# EAGLE design esp8266_minsys (EAGLE 9.6.2)
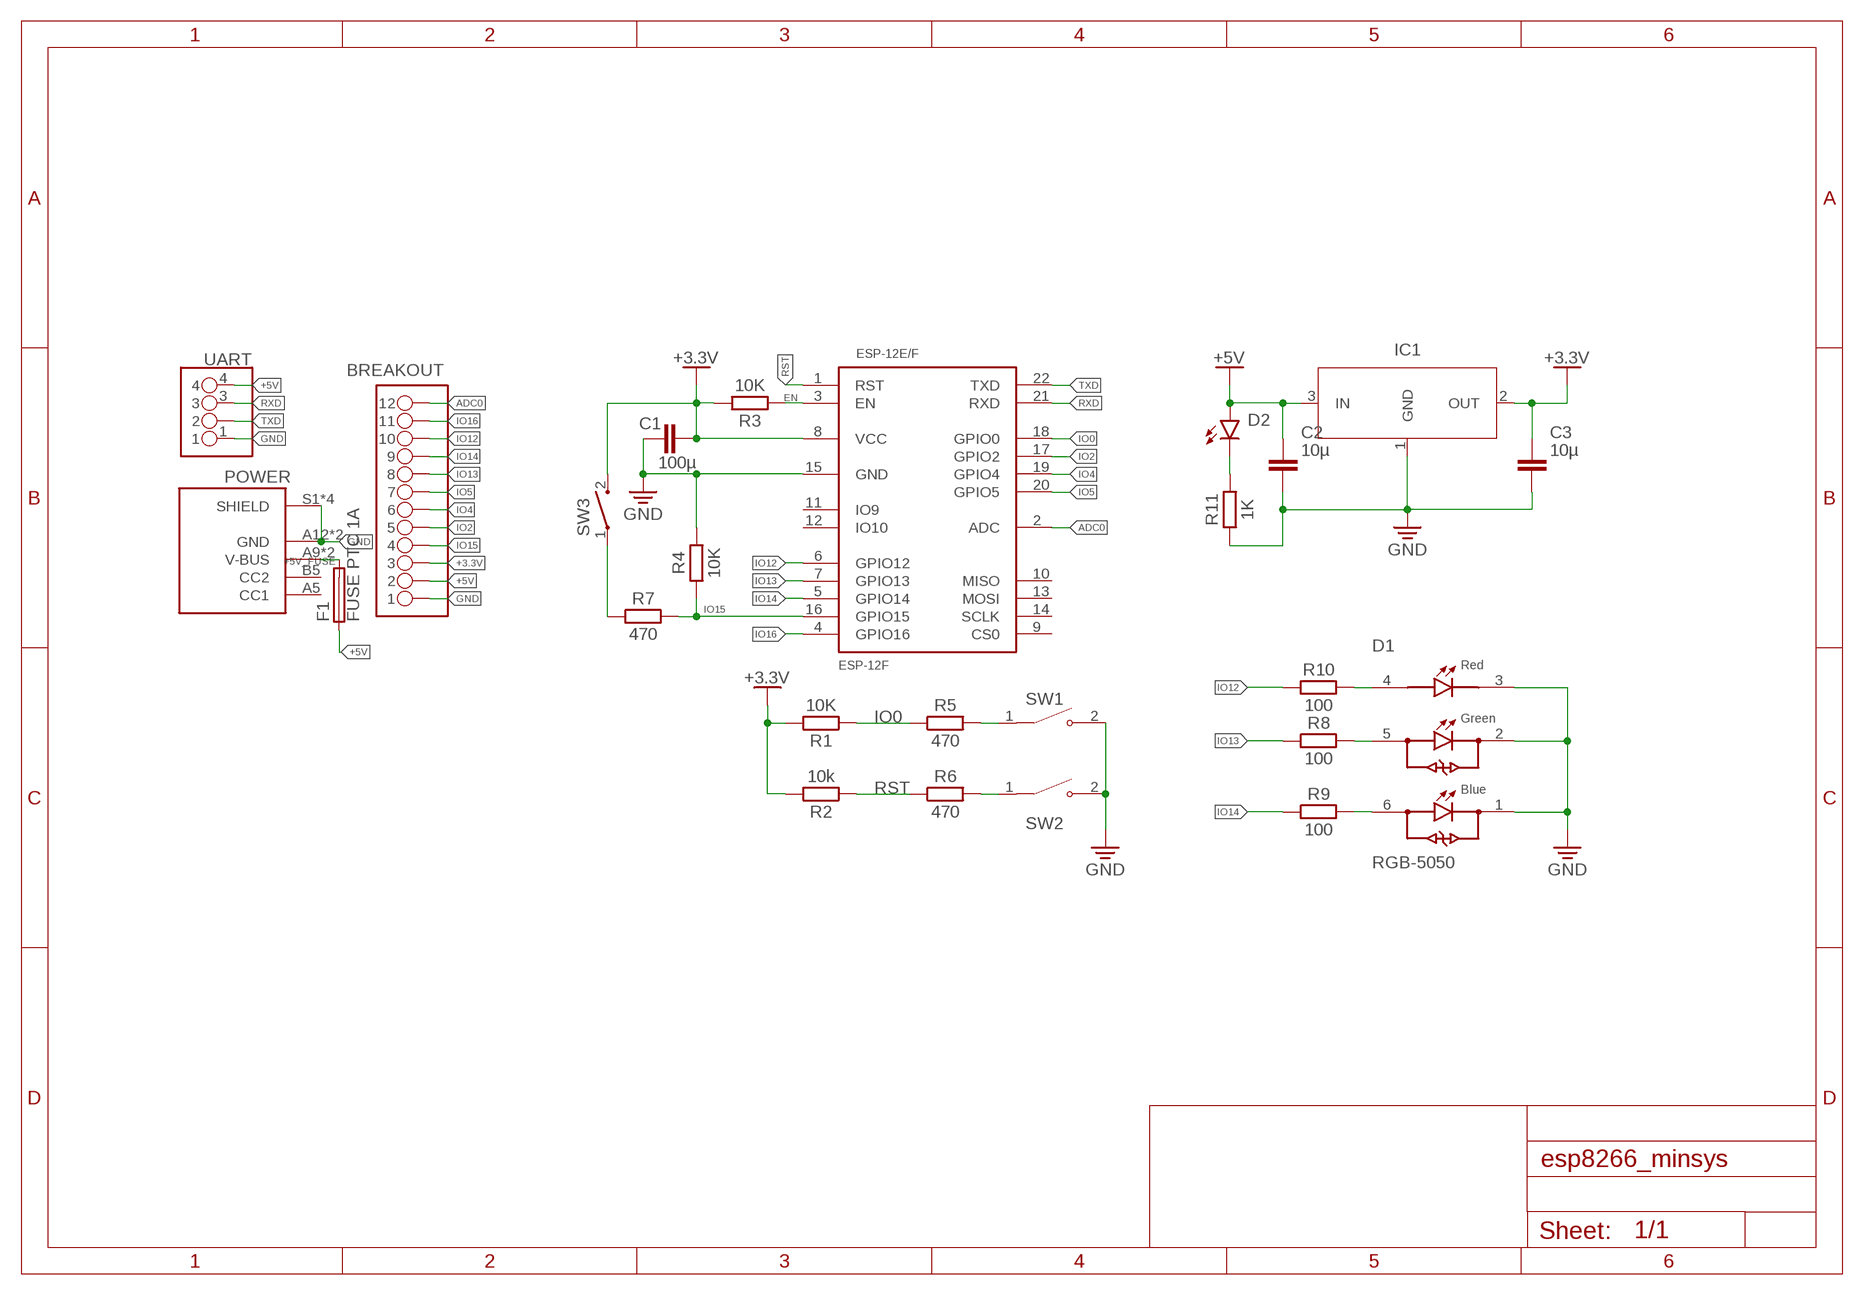
[diagram p0: schematic, sheet 1]

## Parts
BREAKOUT  PINHD-1X12-BACKUP_1X12M  [1X12]
C1  100µ  C_TANTALUM-2412(6032-METRIC)  [CAPM6032X280]
C2  10µ  C_CHIP-0805(2012-METRIC)  [CAPC2012X110]
C3  10µ  C_CHIP-0805(2012-METRIC)  [CAPC2012X110]
D1  RGB-5050  [RGB-5050]
D2  LED_RED  CHIP-FLAT-R_0805  [LEDC2012X110N_FLAT-R]
ESP-12E/F  ESP-12F  [ESP-12F]
F1  FUSE PTC 1A  FUSE_CHIP-1206(3216-METRIC)  [FUSC3215X82N]
IC1  NCP1117ST33T3G  NCP1117ST33T3GSOT-223  [SOT230P700X170-4]
POWER  SOCKET-C  [SOCKET-C]
R1  10K  R_CHIP-0805(2012-METRIC)  [RESC2012X65]
R2  10k  R_CHIP-0805(2012-METRIC)  [RESC2012X65]
R3  10K  R_CHIP-0805(2012-METRIC)  [RESC2012X65]
R4  10K  R_CHIP-0805(2012-METRIC)  [RESC2012X65]
R5  470  R_CHIP-0805(2012-METRIC)  [RESC2012X65]
R6  470  R_CHIP-0805(2012-METRIC)  [RESC2012X65]
R7  470  R_CHIP-0805(2012-METRIC)  [RESC2012X65]
R8  100  R_CHIP-0805(2012-METRIC)  [RESC2012X65]
R9  100  R_CHIP-0805(2012-METRIC)  [RESC2012X65]
R10  100  R_CHIP-0805(2012-METRIC)  [RESC2012X65]
R11  1K  R_CHIP-0805(2012-METRIC)  [RESC2012X65]
SW1  SWITCH-2P  [SWITCH-2P]
SW2  SWITCH-2P  [SWITCH-2P]
SW3  SWITCH  [SW_1437566-3]
UART  PINHD-1X04_1X04M  [1X04]

## Nets
+3.3V: BREAKOUT.3 C1.2 C3.1 ESP-12E/F.8(VCC) IC1.2(OUT) R1.2 R2.2 R3.2 SW3.2
+5V: BREAKOUT.2 C2.1 D2.A F1.1 IC1.3(IN) UART.4
+5V_FUSE: F1.2 POWER.A9(V-BUS) POWER.B9(V-BUS)
ADC0: BREAKOUT.12 ESP-12E/F.2(ADC)
EN: ESP-12E/F.3(EN) R3.1
GND: BREAKOUT.1 C1.1 C2.2 C3.2 D1.1 D1.2 D1.3 ESP-12E/F.15(GND) IC1.1(GND) POWER.A12(GND) POWER.B12(GND) POWER.S1(SHIELD) POWER.S2(SHIELD) POWER.S3(SHIELD) POWER.S4(SHIELD) R4.2 R11.1 SW1.2 SW2.2 UART.1
IO0: ESP-12E/F.18(GPIO0) R1.1 R5.1
IO2: BREAKOUT.5 ESP-12E/F.17(GPIO2)
IO4: BREAKOUT.6 ESP-12E/F.19(GPIO4)
IO5: BREAKOUT.7 ESP-12E/F.20(GPIO5)
IO12: BREAKOUT.10 ESP-12E/F.6(GPIO12) R10.1
IO13: BREAKOUT.8 ESP-12E/F.7(GPIO13) R8.1
IO14: BREAKOUT.9 ESP-12E/F.5(GPIO14) R9.1
IO15: BREAKOUT.4 ESP-12E/F.16(GPIO15) R4.1 R7.2
IO16: BREAKOUT.11 ESP-12E/F.4(GPIO16)
N$2: D1.4 R10.2
N$3: D1.5 R8.2
N$4: D1.6 R9.2
N$5: R5.2 SW1.1
N$6: R6.2 SW2.1
N$7: R7.1 SW3.1
N$9: D2.C R11.2
RST: ESP-12E/F.1(RST) R2.1 R6.1
RXD: ESP-12E/F.21(RXD) UART.3
TXD: ESP-12E/F.22(TXD) UART.2
Unconnected: ESP-12E/F.9(CS0) ESP-12E/F.10(MISO) ESP-12E/F.11(IO9) ESP-12E/F.12(IO10) ESP-12E/F.13(MOSI) ESP-12E/F.14(SCLK) POWER.A5(CC1) POWER.B5(CC2)

## Library data of the parts
BREAKOUT = Tinkercad:PINHD-1X12-BACKUP
C1-C3 = Capacitor:C: Capacitor - Generic; CATEGORY: Capacitor
D1 = WorTel2023:RGB-5050: LED; SMD; 5050, PLCC6; RGB; 5x5x1.6mm; 120°; 20mA; Lens: transparent; MANUFACTURER: Lite-On; MAXIMUM_PACKAGE_HEIGHT: 1.8 mm; PARTREV: D; STANDARD: Manufacturer Recommendations
D2 = LED:CHIP-FLAT-R; CATEGORY: LED; COLOR: RED; DESCRIPTION: CHIP LED FLAT; SUB-CATEGORY: CHIP; TYPE: FLAT_TOP
ESP-12E/F = WorTel2023:ESP-12F
F1 = Circuit-Protection:FUSE: Fuse - Generic; CATEGORY: Circuit-Protection; SUB-CATEGORY: Fuse
IC1 = IC_Power-Management:NCP1117ST33T3G: 1.0 A Low-Dropout Positive Fixed and Adjustable Voltage Regulators Datasheet <https://www.onsemi.com/pub/Collateral/NCP1117-D.PDF>; CATEGORY: IC_Power-Management; MANUFACTURER: ON Semiconductor; MPN: NCP1117ST33T3G; OPERATING_TEMP: 0 to +125 °C; PART_STATUS: Active; ROHS_COMPLIANT: RoHS3 Compliant; SERIES: NCP1117, NCV1117; SUB-CATEGORY: Voltage Regulator; TYPE: Linear
POWER = WorTel2023:SOCKET-C: Type C, 3 A, Right Angle, Surface Mount (SMT), Power-Only USB Receptacle; MANUFACTURER: CUI Devices; MAXIMUM_PACKAGE_HEIGHT: 3.16mm; PARTREV: 04/30/2020; STANDARD: Manufacturer recommendations
R1-R11 = Resistor:R: Resistor Fixed - Generic; CATEGORY: Resistor; SUB-CATEGORY: Fixed
SW1 SW2 = WorTel2023:SWITCH-2P; MANUFACTURER: CUI Devices; MAXIMUM_PACKAGE_HEIGHT: 2.5 mm; PARTREV: 1.0; STANDARD: Manufacturer Recommendations
SW3 = XLKM#4:SWITCH: Switch Tactile OFF (ON) SPST Rectangular Button Gull Wing 0.05A 12VDC SMD Loose Piece; MANUFACTURER: TE CONNECTIVITY; PARTREV: C2; STANDARD: Manufacturer recommendations
UART = Tinkercad:PINHD-1X04

## Board
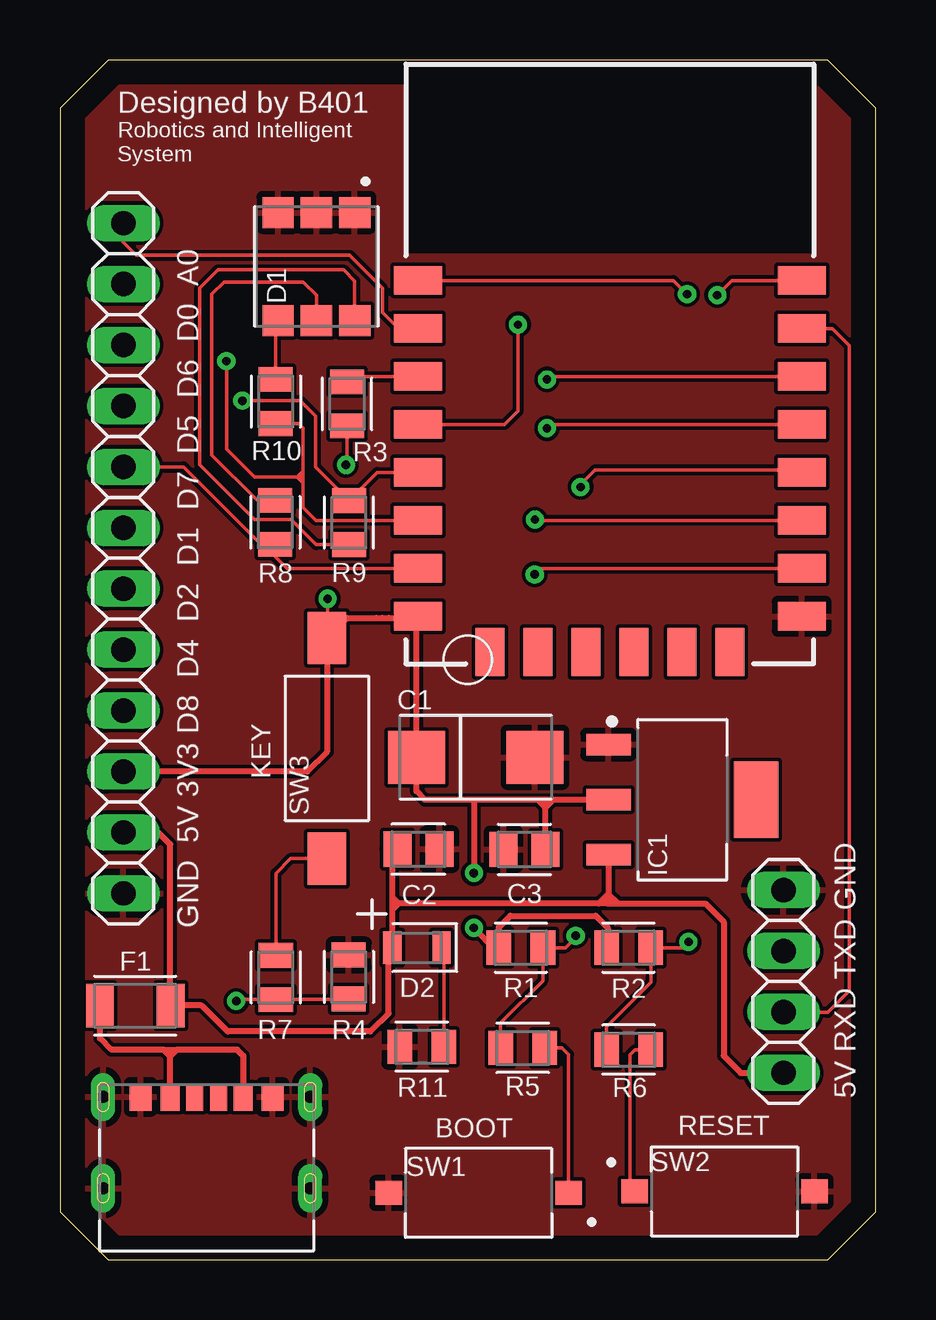
[diagram p1: board, top side]
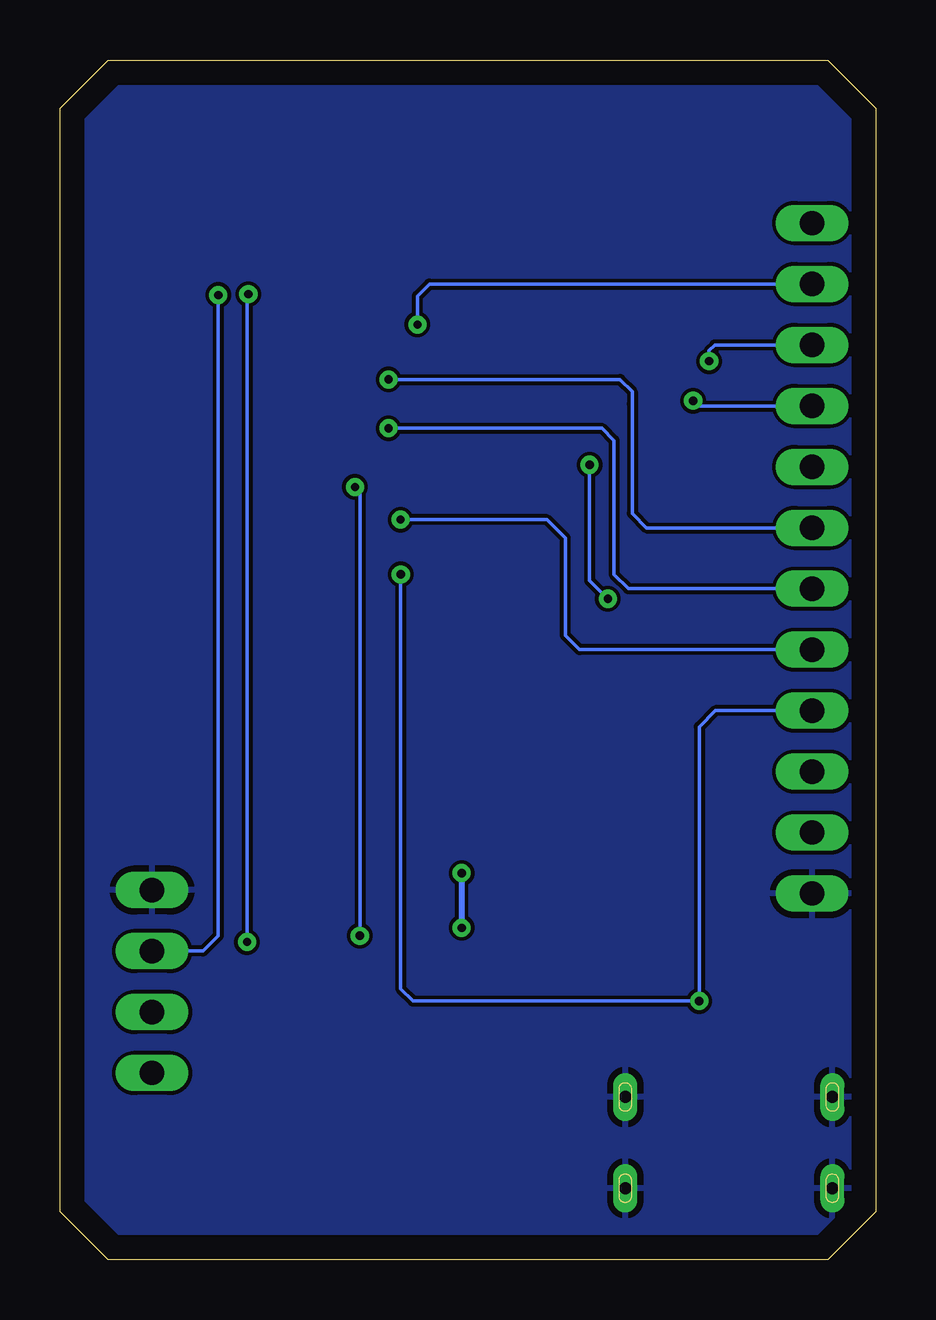
[diagram p2: board, bottom side, seen from below]

Size 34 x 50 mm. Coordinates in mm from the lower left corner, seen from the top.
Outline: 2,0 32,0 34,2 34,48 32,50 2,50 0,48 0,2 2,0
Copper layers (1*16): Top 0.035mm / dielectric 1.5mm / Bottom 0.035mm
Design rules "default *": minimum track width 6mil, minimum drill 0.3mm, track to track 6mil, track to pad 6mil, pad to pad 6mil, via to via 6mil, smd to smd 6mil, copper to edge 40mil, drill to drill 6mil, minimum pad ring 10mil, minimum via ring 8mil, stop-mask expansion 4mil, vias tented up to drill 0mil, thermal gap 10mil

### Footprints (pad centres in the part's own frame; a part is rotated, then mirrored left to right if it is on the bottom)
1X12 = drill 1.016 long: 1 -13.97,0; 2 -11.43,0; 3 -8.89,0; 4 -6.35,0; 5 -3.81,0; 6 -1.27,0; 7 1.27,0; 8 3.81,0; 9 6.35,0; 10 8.89,0; 11 11.43,0; 12 13.97,0
CAPM6032X280 = smd 2.368 x 2.204: 1 -2.471,0; 2 2.471,0
CAPC2012X110 = smd 1.165 x 1.465: 1 -0.875,0; 2 0.875,0
RGB-5050 = smd 1.3 x 1.3: 1 -2.25,1.6; 2 -2.25,0; 3 -2.25,-1.6; 4 2.25,-1.6; 5 2.25,0; 6 2.25,1.6
LEDC2012X110N_FLAT-R = smd 0.762 x 1.362: A 1.025,0; C -1.025,0
ESP-12F = smd 2 x 1.2: 1 -8,3.48; 2 -8,1.48; 3 -8,-0.52; 4 -8,-2.52; 5 -8,-4.52; 6 -8,-6.52; 7 -8,-8.52; 8 -8,-10.52; 15 8,-10.52; 16 8,-8.52; 17 8,-6.52; 18 8,-4.52; 19 8,-2.52; 20 8,-0.52; 21 8,1.48; 22 8,3.48 | smd 1.2 x 2: 9 -5,-12; 10 -3,-12; 11 -1,-12; 12 1,-12; 13 3,-12; 14 5,-12
FUSC3215X82N = smd 1.165 x 1.814: 1 -1.475,0; 2 1.475,0
SOT230P700X170-4 = smd 1.86 x 0.898: 1 -3.075,2.3; 2 -3.075,0; 3 -3.075,-2.3 | smd 1.86 x 3.189: 4 3.075,0
SOCKET-C = smd 0.7 x 1.15: A5 -0.5,0.005; B5 0.5,0.005 | smd 0.8 x 1.15: A9 1.52,0.005; B9 -1.52,0.005 | smd 0.9 x 1.15: A12 2.75,0.005; B12 -2.75,0.005 | drill 0.5 pad 1 long: S1 -4.32,0; S2 4.32,0; S3 -4.32,-3.8; S4 4.32,-3.8
RESC2012X65 = smd 1.031 x 1.42: 1 -0.919,0; 2 0.919,0
SWITCH-2P = smd 1.1 x 1: 1 -3.75,0; 2 3.75,0
SW_1437566-3 = smd 2.18 x 1.6: 1 -4.6,0; 2 4.6,0
1X04 = drill 1.016 long: 1 -3.81,0; 2 -1.27,0; 3 1.27,0; 4 3.81,0

### Placement (x,y rotation side)
BREAKOUT  2.64,29.23 90 top
C1  17.33,20.93 180 top
C2  14.94,17.11 0 top
C3  19.37,17.1 180 top
D1  10.69,41.39 270 top
D2  14.88,13 180 top
ESP-12E/F  22.93,37.33 0 top
F1  3.14,10.58 180 top
IC1  25.95,19.17 0 top
POWER  6.12,6.77 0 top
R1  19.21,13 180 top
R2  23.71,13 180 top
R3  11.97,35.67 270 top
R4  12.04,11.78 90 top
R5  19.29,8.82 0 top
R6  23.71,8.75 0 top
R7  9,11.75 270 top
R8  8.98,30.73 90 top
R9  12.05,30.72 270 top
R10  9,35.77 90 top
R11  15.08,8.87 0 top
SW1  17.45,2.78 180 top
SW2  27.7,2.84 0 top
SW3  11.13,21.31 90 top
UART  30.16,11.59 270 top

### Tracks (layer width: path | path; a pad name or v marks a point on that pad's centre or on a via)
+3.3V  (via drill 0.35)
  Top 0.152: 11.97,34.35 R3.2 11.97,33.18 v11.92,33.13 | v11.16,27.54 11.16,25.88 11.22,25.82
  Top 0.254: 15.43,21.5 C1.2 | SW3.2 11.22,25.82 11.79,25.25 | IC1.2 20.56,19.17 | 20.56,19.17 20.05,19.17 | 20.05,19.17 19.93,19.17 | 19.93,19.17 17.25,19.17 | 17.25,19.17 15.21,19.17 14.86,19.52 C1.2 | C1.2 14.86,26.75 | 14.86,26.75 ESP-12E/F.8 | SW3.2 11.96,26.75 13.19,26.75 13.44,26.75 13.7,26.75 14.86,26.75 | C3.1 20.24,18.85 | 20.24,18.85 20.56,19.17 | 20.24,18.85 20.24,18.97 20.05,19.17 | 20.24,18.85 19.93,19.17 | 17.25,19.17 v17.25,16.11 | v17.25,13.82 18.12,12.96 R1.2 18.29,13.85 18.78,14.33 22.33,14.33 22.84,13.82 22.84,12.98 R2.2 22.84,12.86 | SW3.2 11.13,21.16 10.31,20.34 BREAKOUT.3
  Bottom 0.152: v11.92,33.13 11.92,28.3 v11.16,27.54
  Bottom 0.254: v17.25,16.11 v17.25,13.82
+5V
  Top 0.254: BREAKOUT.2 4.1,17.8 4.6,17.3 4.6,10.61 F1.1 5.92,10.58 6.99,9.51 12.94,9.51 13.7,10.27 13.7,13.05 D2.A 13.86,14.59 | C2.1 13.95,17.11 | 13.95,17.11 13.6,17.11 | IC1.3 22.87,15.25 | 22.46,14.84 22.87,15.25 | UART.4 28.38,7.78 27.67,8.49 27.67,14.08 26.91,14.84 23.28,14.84 | 22.84,14.84 22.46,14.84 | 22.84,14.84 23.28,14.84 | 23.28,14.84 22.87,15.25 | 22.87,15.25 22.87,14.87 22.84,14.84 | 13.86,14.59 13.86,15.09 | 13.86,15.09 13.86,17.01 13.95,17.11 | 22.46,14.84 14.11,14.84 | 14.11,14.84 13.86,15.09 | 14.11,14.84 13.86,14.59
+5V_FUSE
  Top 0.152: 7.7,6.6 7.7,6.71 POWER.A9
  Top 0.254: 7.63,6.78 POWER.A9 7.64,8.49 7.39,8.74 4.87,8.74 | F1.2 1.67,9.22 2.14,8.74 4.33,8.74 | POWER.B9 4.6,8.47 | 4.6,8.47 4.6,8.48 4.33,8.74 | 4.87,8.74 4.6,8.47 | 4.33,8.74 4.87,8.74
ADC0
  Top 0.152: BREAKOUT.12 2.64,42.4 3.18,41.86 12.07,41.86 13.44,40.49 13.44,39.48 14.11,38.81 ESP-12E/F.2
EN
  Top 0.152: 14.7,36.59 ESP-12E/F.3 12.2,36.81 R3.1
GND
  pour Top: -0.27,48.13 -0.27,1.62 1.85,-0.51 32.15,-0.51 34.58,1.92 34.58,48.08 32.26,50.4 2,50.4
  cutout Top: 14.46,49.89 14.46,42.03 14.48,42.02 31.48,42.02 31.48,49.89
  pour Bottom: -0.27,48.13 -0.27,1.62 1.85,-0.51 32.15,-0.51 34.58,1.92 34.58,48.08 32.26,50.4 2,50.4
IO0  (via drill 0.35)
  Top 0.152: ESP-12E/F.18 30.83,32.91 22.31,32.91 21.7,32.3 v21.7,32.2 | v21.5,13.49 21.5,13.43 21.07,13 R1.1 20.13,11.62 18.37,9.86 R5.1
  Bottom 0.152: v21.7,32.2 21.5,32 v21.5,13.49
IO2  (via drill 0.35)
  Top 0.152: ESP-12E/F.17 19.83,30.81 v19.8,30.84
  Bottom 0.152: BREAKOUT.5 12.34,25.42 12.94,26.02 12.94,30.08 13.7,30.84 v19.8,30.84
IO4  (via drill 0.35)
  Top 0.152: ESP-12E/F.19 20.46,34.81 v20.3,34.65
  Bottom 0.152: v20.3,34.65 11.41,34.65 10.9,34.14 10.9,28.56 10.31,27.96 BREAKOUT.6
IO5  (via drill 0.35)
  Top 0.152: ESP-12E/F.20 20.43,36.81 v20.3,36.68
  Bottom 0.152: v20.3,36.68 10.65,36.68 10.14,36.18 10.14,35.67 10.14,31.1 9.55,30.5 BREAKOUT.7
IO12  (via drill 0.35)
  Top 0.152: ESP-12E/F.6 10.68,30.81 10.14,31.35 10.14,32.37 | 10.14,32.37 10.14,32.62 | 10.14,32.62 10.14,32.87 | 10.14,32.87 10.14,34.65 9.95,34.85 R10.1 | v6.94,37.45 6.94,33.79 8.11,32.62 9.89,32.62 | 10.14,32.62 9.89,32.62 | 9.89,32.62 10.14,32.87 | 9.89,32.62 10.14,32.37
  Bottom 0.152: v6.94,37.45 6.94,37.88 6.7,38.12 BREAKOUT.10
IO13
  Top 0.152: ESP-12E/F.7 9.47,28.81 8.98,29.3 R8.1 8.38,29.81 5.15,33.04 BREAKOUT.8
IO14  (via drill 0.35)
  Top 0.152: ESP-12E/F.5 13.22,32.81 R9.1 10.65,33.04 10.65,35.16 10.02,35.8 v7.6,35.8
  Bottom 0.152: v7.6,35.8 7.39,35.58 BREAKOUT.9
IO15  (via drill 0.35)
  Top 0.152: R4.1 12.01,10.84 R7.2 7.41,10.84 v7.35,10.78 | ESP-12E/F.16 20.05,28.81 v19.79,28.56
  Bottom 0.152: v19.79,28.56 19.79,11.28 19.29,10.78 v7.35,10.78 7.35,22.21 6.67,22.88 BREAKOUT.4
IO16  (via drill 0.35)
  Top 0.152: v19.09,38.97 19.09,35.37 18.54,34.81 ESP-12E/F.4
  Bottom 0.152: v19.09,38.97 19.09,40.16 18.6,40.66 BREAKOUT.11
N$2
  Top 0.152: R10.2 9,39.05 D1.4
N$3
  Top 0.152: 10.14,38.59 D1.5 10.69,40.2 10.14,40.75 6.84,40.75 6.33,40.24 6.33,33.53 8.21,31.65 R8.2
N$4
  Top 0.152: 12.29,39.08 D1.6 12.29,40.79 11.82,41.26 6.59,41.26 5.82,40.49 5.82,33.13 8.11,30.84 9.63,30.84 10.68,29.8 R9.2
N$5
  Top 0.152: SW1.1 21.2,8.55 20.93,8.82 R5.2
N$6
  Top 0.152: SW2.1 23.75,3.04 23.75,8.53 23.97,8.75 R6.2
N$7
  Top 0.152: R7.1 9,16.1 9.61,16.71 SW3.1
N$9
  Top 0.152: R11.2 16,12.8 D2.C
RST  (via drill 0.35)
  Top 0.152: v26.2,13.24 26.2,13.2 26,13 R2.1 24.62,11.54 22.79,9.71 R6.1 | ESP-12E/F.1 25.57,40.81 v26.14,40.24
  Bottom 0.152: v26.14,40.24 26.2,40.18 v26.2,13.24
RXD
  Top 0.152: ESP-12E/F.21 32.19,38.81 32.9,38.1 32.9,11.2 32,10.3 30.18,10.3 UART.3
TXD  (via drill 0.35)
  Top 0.152: ESP-12E/F.22 28.01,40.81 v27.4,40.2
  Bottom 0.152: v27.4,40.2 27.4,13.5 28.04,12.86 UART.2

### Text on the board
tPlace: Designed by B401 | Robotics and Intelligent / System
tNames: KEY | GND 5V 3V3 D8 D4 D2 D1 D7 D5 D6 D0 A0 | 5V RXD TXD GND | BOOT | RESET